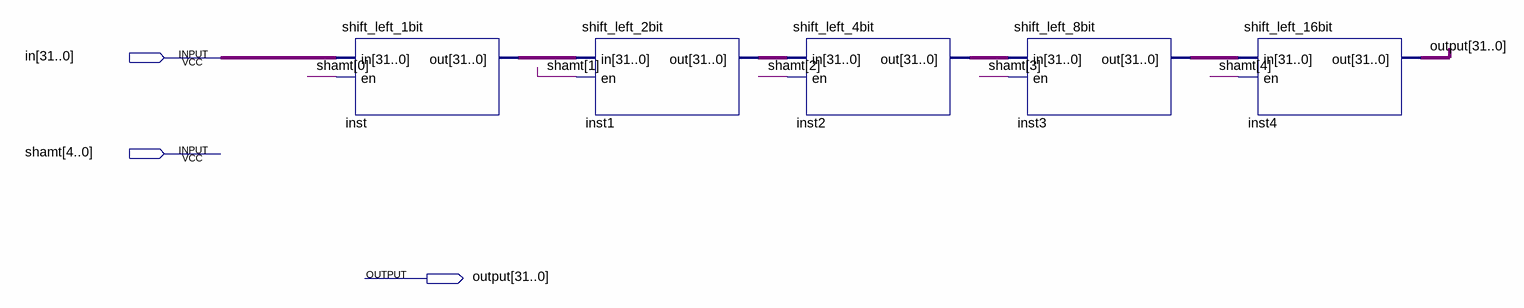
[diagram p0: schematic sheet]
// Quartus schematic shift_left_32bit.bdf as structural Verilog: 5 symbols, 3 pins
module shift_left_32bit (
  input  [31:0] in,
  input  [4:0] shamt,
  output [31:0] \output 
);

  wire [31:0] inst1_out, inst2_out, inst3_out, inst_out;

  shift_left_1bit inst (.in(in), .en(shamt[0]), .out(inst_out));
  shift_left_2bit inst1 (.in(inst_out), .en(shamt[1]), .out(inst1_out));
  shift_left_4bit inst2 (.in(inst1_out), .en(shamt[2]), .out(inst2_out));
  shift_left_8bit inst3 (.in(inst2_out), .en(shamt[3]), .out(inst3_out));
  shift_left_16bit inst4 (.in(inst3_out), .en(shamt[4]), .out(\output ));
endmodule
